# Altium schematic sheet 06-ETHERNET.SchDoc
size A4
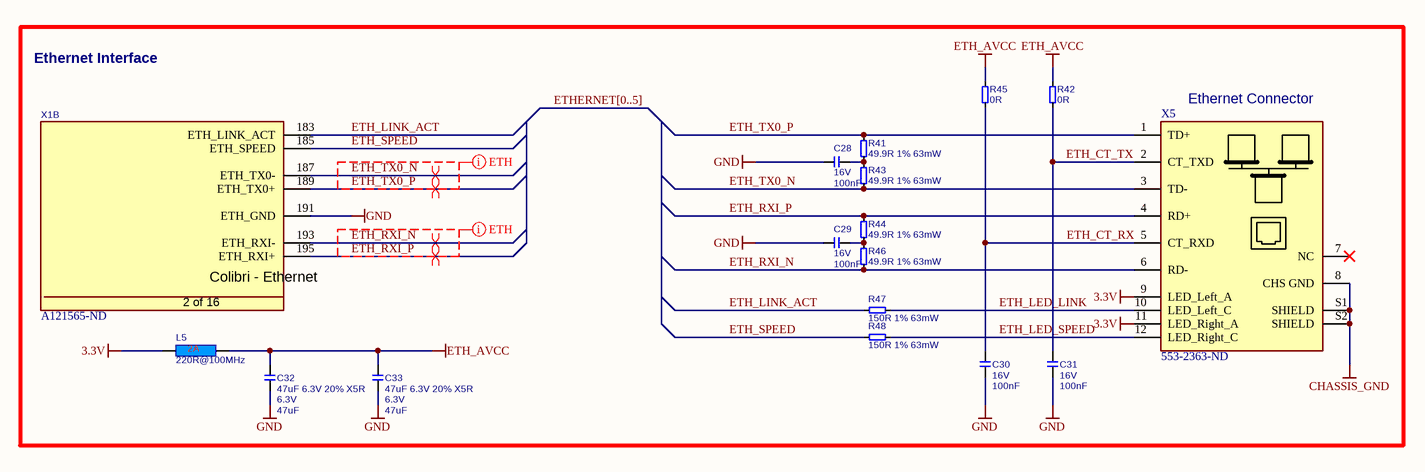
[diagram p0: 06-ETHERNET.SchDoc]

## Parts
C28  value 100nF  Rating: 16V  [CAPC1005X60N]  (hidden comment: 100nF 16V 10% X7R)
C29  value 100nF  Rating: 16V  [CAPC1005X60N]  (hidden comment: 100nF 16V 10% X7R)
C30  value 100nF  Rating: 16V  [CAPC1005X60N]  (hidden comment: 100nF 16V 10% X7R)
C31  value 100nF  Rating: 16V  [CAPC1005X60N]  (hidden comment: 100nF 16V 10% X7R)
C32  47uF 6.3V 20% X5R  value 47uF  Rating: 6.3V  [T_CAPC0603X33N]
C33  47uF 6.3V 20% X5R  value 47uF  Rating: 6.3V  [T_CAPC0603X33N]
L5  value 220R@100MHz  [INDC2012X140N]  (hidden comment: BLM21PG221SN1D)
R41  49.9R 1% 63mW  [RESC1005X40N]
R42  0R  [RESC1005X40N]
R43  49.9R 1% 63mW  [RESC1005X40N]
R44  49.9R 1% 63mW  [RESC1005X40N]
R45  0R  [RESC1005X40N]
R46  49.9R 1% 63mW  [RESC1005X40N]
R47  150R 1% 63mW  [RESC1005X40N]
R48  150R 1% 63mW  [RESC1005X40N]
X1  Supplier Part Number 1: A121565-ND  [T_Tyco_1473005-1]  (hidden comment: 1473005-1)  (part B of 16)
X5  Supplier Part Number 1: 553-2363-ND  [T_PULSE_JD2-0001NL]  (hidden comment: JD2-0001NL)

## Nets
3.3V: L5.2 X5.9(LED_Left_A) X5.11(LED_Right_A)
CHASSIS_GND: X5.8(CHS_GND) X5.S1(SHIELD) X5.S2(SHIELD)
ETH_AVCC: C32.2 C33.2 L5.1 R42.2 R45.2
GND: C28.2 C29.2 C30.1 C31.1 C32.1 C33.1 X1.191(ETH_GND)
ETH_CT_RX: C30.2 R45.1 X5.5(CT_RXD)
ETH_CT_TX: C31.2 R42.1 X5.2(CT_TXD)
ETH_LED_LINK: R47.1 X5.10(LED_Left_C)
ETH_LED_SPEED: R48.1 X5.12(LED_Right_C)
ETH_LINK_ACT: R47.2 X1.183(ETH_LINK_ACT)
ETH_RXI_N: R46.1 X1.193(ETH_RXI-) X5.6(RD-)
ETH_RXI_P: R44.2 X1.195(ETH_RXI+) X5.4(RD+)
ETH_SPEED: R48.2 X1.185(ETH_SPEED)
ETH_TX0_N: R43.1 X1.187(ETH_TX0-) X5.3(TD-)
ETH_TX0_P: R41.2 X1.189(ETH_TX0+) X5.1(TD+)
NetC28_1: C28.1 R41.1 R43.2
NetC29_1: C29.1 R44.1 R46.2

Not connected (* = marked no-connect by the designer): X5 7(NC)*

## Buses and harness runs
bus ETHERNET[0..5]

## Layout directives
differential pair: ETH_RXI_N, ETH_RXI_P, ETH_TX0_N, ETH_TX0_P
net class USB: ETH_RXI_N, ETH_RXI_P, ETH_TX0_N, ETH_TX0_P

## Notes on the sheet
- Ethernet Interface
- (near X5) Ethernet Connector
- (in symbol CON-Tyco-1473005-1-200-0.6mm, part B) Colibri - Ethernet; 2 of 16
- (in symbol L-Murata-220R@100MHz-2A-0805) 2A

## Library data of the parts
C28-C31 = C-100nF-16V-10%-0603: Capacitor Ceramic X7R 100nF 16V 10% 0603; FP_DESC: C0402; Tolerance: 10%; Type: X7R; Supplier 1: Digi-Key; Supplier Part Number 1: 1276-1001-1-ND; Footprint Checked: -; MFG: *; MFG_PN: *
C32 C33 = C-47uF-6.3V-20%-0603: Capacitor Ceramic X5R 47uF 6.3V 20% 0603; FP_DESC: C0603; Tolerance: 20%; Type: X5R; Supplier 1: Digi-Key; Supplier Part Number 1: 490-13247-1-ND; MFG: *; MFG_PN: *
L5 = L-Murata-220R@100MHz-2A-0805: 220 Ohms @ 100MHz 1 Power Line Ferrite Bead 0805 (2012 Metric) 2A 45mOhm; Rating: 4A; Tolerance: 25%; MFG: EXC-ML20A390U; Supplier 1: Digi-Key; Supplier Part Number 1: 490-1054-1-ND; Footprint Checked: -; Symbol Checked: -
R41 R43 R44 R46 = R-49.9R-1%-0402: Resistor 49.9ohm 63mW 1% 0402; Manufacturer: <GENERIC>; Value: 49.9; Replacement Allowed: Yes; Power: 63mW; Tolerance: 1%; Footprint: R0402; Supplier 1: Digi-Key; Supplier Part Number 1: 541-49.9LCT-ND; Manufacturer Part Number: <GENERIC>
R42 R45 = R-0R-0402: Resistor 0ohm 0402; Tolerance: 1%; MFG: <GENERIC>; Power: ?; Value: 0R; Footprint: R0402; Supplier 1: Digi-Key; Supplier Part Number 1: 541-2952-1-ND; Footprint Checked: -; Symbol Checked: -; MFG_PN: <GENERIC>
R47 R48 = R-150R-1%-0402: Resistor 150ohm 63mW 1% 0402; MFG: <GENERIC>; Power: 63mW; Tolerance: 1%; Footprint: R0402; Value: 150R; Supplier 1: Digi-Key; Supplier Part Number 1: 541-CRCW0402150RFKTDCT-ND; Footprint Checked: -; Symbol Checked: -; MFG_PN: <GENERIC>
X1 = CON-Tyco-1473005-1-200-0.6mm: SODIMM Connector; Manufacturer Name: Tyco; No. of ways: 200; Supplier 1: Digi-Key; Manufacturer Part No.: 1473005-1
X5 = CON-Pulse-JD2-0001NL: 1 Port RJ45 Magjack Connector Through Hole 10/100 Base-TX, AutoMDIX; MFG: Pulse Electronics Network; MFG_PN: J00-0065NL; Footprint Checked: -; Symbol Checked: -; Supplier 1: Digi-Key